# EasyEDA schematic SCH_esp32_ubidots_dth11_2022-10-09.json
TITLE: CONNECTION TO ESP32 WITH DHT11 AND A BUTTON; REV: 1.0; Date: 2022-10-09; Sheet: 1/1; Drawn By: David Charry; Company: UNIVERSIDAD SERGIO ARBOLEDA
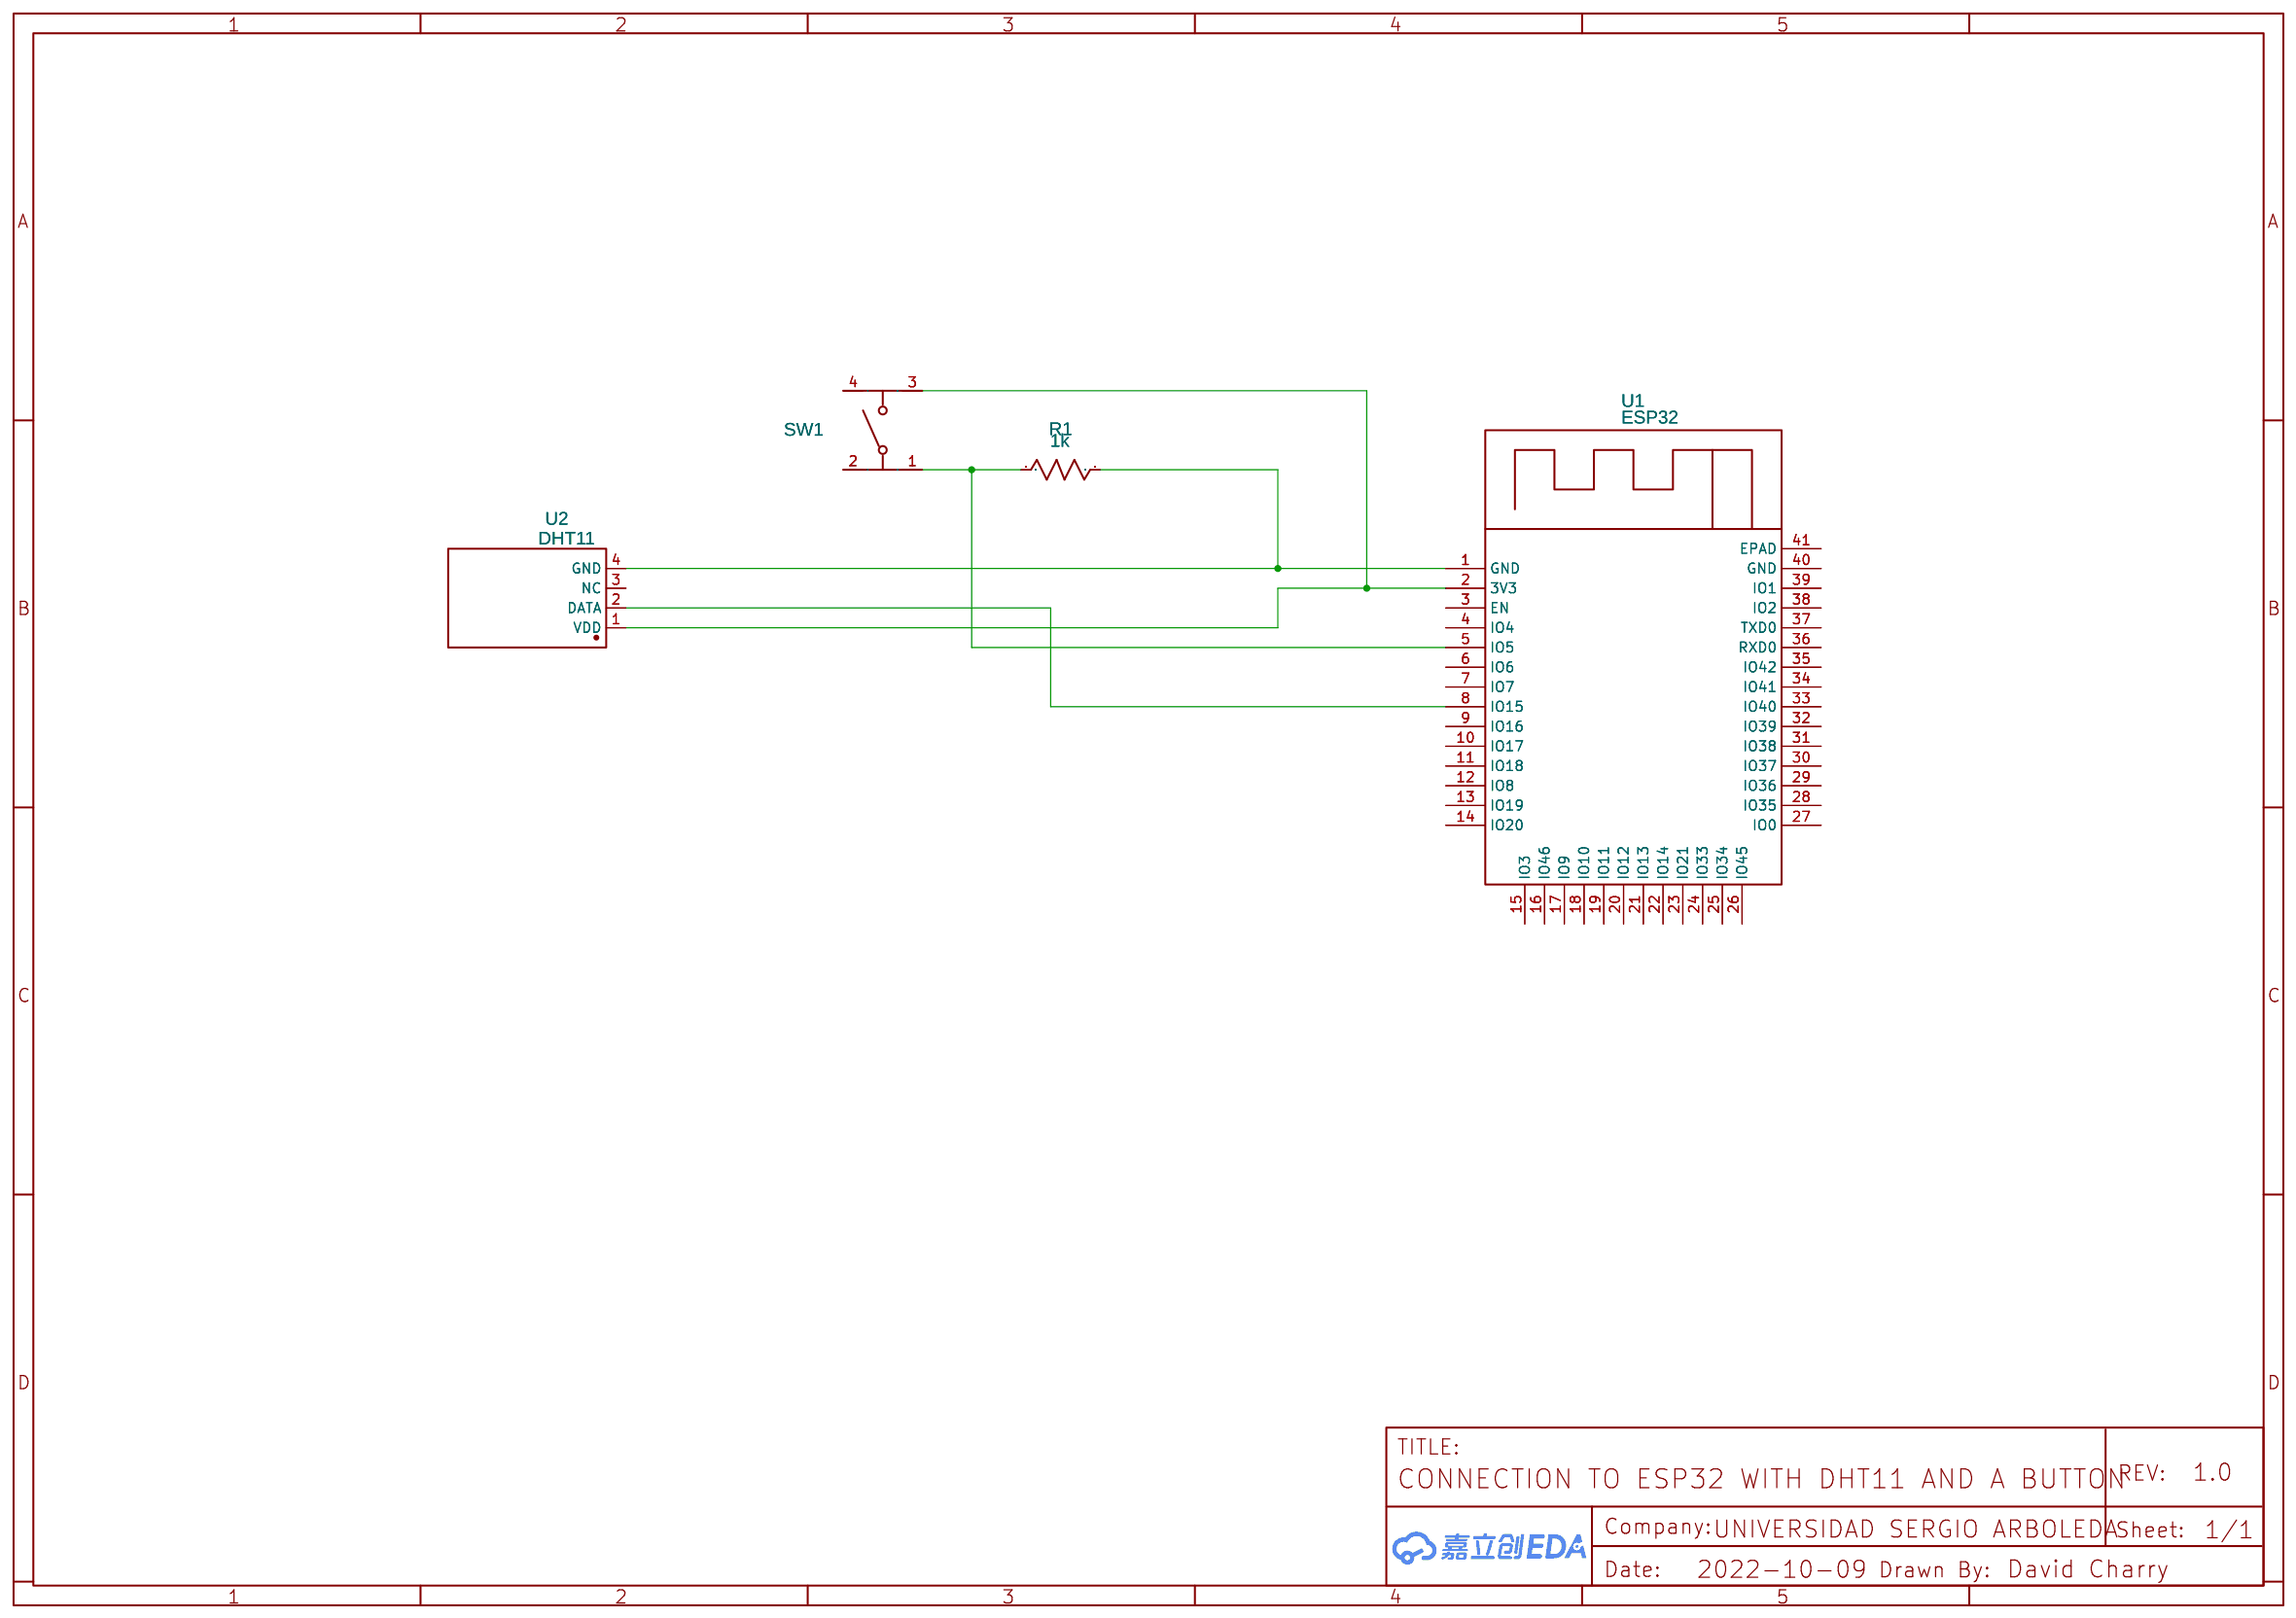
[diagram p0: schematic sheet]

## Parts
R1  1k  [R0603]
SW1  Button-6x6x6mm  [SW-TH_4P-L6.0-W6.0-P4.50-LS6.1]
U1  ESP32  [WIRELM-SMD_ESP32-S3-WROOM-1]
U2  DHT11  [SENSOR-TH_DHT11]

## Library data of the parts
R1 = R_0603_US: Contributor: LCEDA_Lib
SW1 = Button-6x6x6mm: Supplier Part: C71836; Supplier: LCSC; Manufacturer: BBJ; Manufacturer Part: Switch,6*6*6Plastic head,260G, 0.25mm,Straight line
U1 = ESP32-S2-SOLO-N4R2: Supplier: LCSC; Supplier Part: C3013947; Manufacturer: ESPRESSIF(乐鑫); link: https://atta.szlcsc.com/upload/public/pdf/source/20220628/2894B12BA7555FAA711E4172174B74F3.pdf; JLCPCB Part Class: Extended Part; Contributor: lcsc
U2 = DHT11: Supplier: LCSC; Supplier Part: C117051; Manufacturer: Aosong (Guangzhou) Elec; Contributor: LCSC; JLCPCB Part Class: Extended Part

## Nets
Net-(R1-1): R1.1 U1.1(GND) U2.4(GND)
Net-(R1-2): R1.2 SW1.1 U1.5(IO5)
Net-(SW1-3): SW1.3 U1.2(3V3) U2.1(VDD)
Net-(U1-8): U1.8(IO15) U2.2(DATA)

Not connected (* = marked no-connect by the designer): SW1 2 4; U1 3(EN) 4(IO4) 6(IO6) 7(IO7) 9(IO16) 10(IO17) 11(IO18) 12(IO8) 13(IO19) 14(IO20) 15(IO3) 16(IO46) 17(IO9) 18(IO10) 19(IO11) 20(IO12) 21(IO13) 22(IO14) 23(IO21) 24(IO33) 25(IO34) 26(IO45) 27(IO0) 28(IO35) 29(IO36) 30(IO37) 31(IO38) 32(IO39) 33(IO40) 34(IO41) 35(IO42) 36(RXD0) 37(TXD0) 38(IO2) 39(IO1) 40(GND) 41(EPAD); U2 3(NC)
